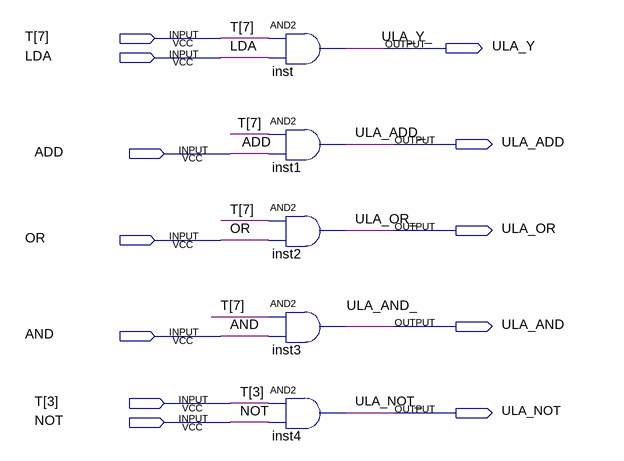
[diagram p0: schematic sheet]
// Quartus schematic UNIDADE_CONTROLE_ULA.bdf as structural Verilog: 5 symbols, 12 pins
module UNIDADE_CONTROLE_ULA (
  input  [7:3] T,
  input  LDA,
  input  ADD,
  input  OR,
  input  AND,
  input  NOT,
  output ULA_Y,
  output ULA_ADD,
  output ULA_OR,
  output ULA_AND,
  output ULA_NOT
);

  and inst (ULA_Y, T[7], LDA);
  and inst1 (ULA_ADD, T[7], ADD);
  and inst2 (ULA_OR, T[7], OR);
  and inst3 (ULA_AND, T[7], AND);
  and inst4 (ULA_NOT, T[3], NOT);

  // Other names for the same wires on the sheet: ULA_ADD_ = ULA_ADD; ULA_AND_ = ULA_AND; ULA_NOT_ = ULA_NOT;
  //   ULA_OR_ = ULA_OR; ULA_Y_ = ULA_Y
endmodule
